# Altium project 1_led.PrjPcb
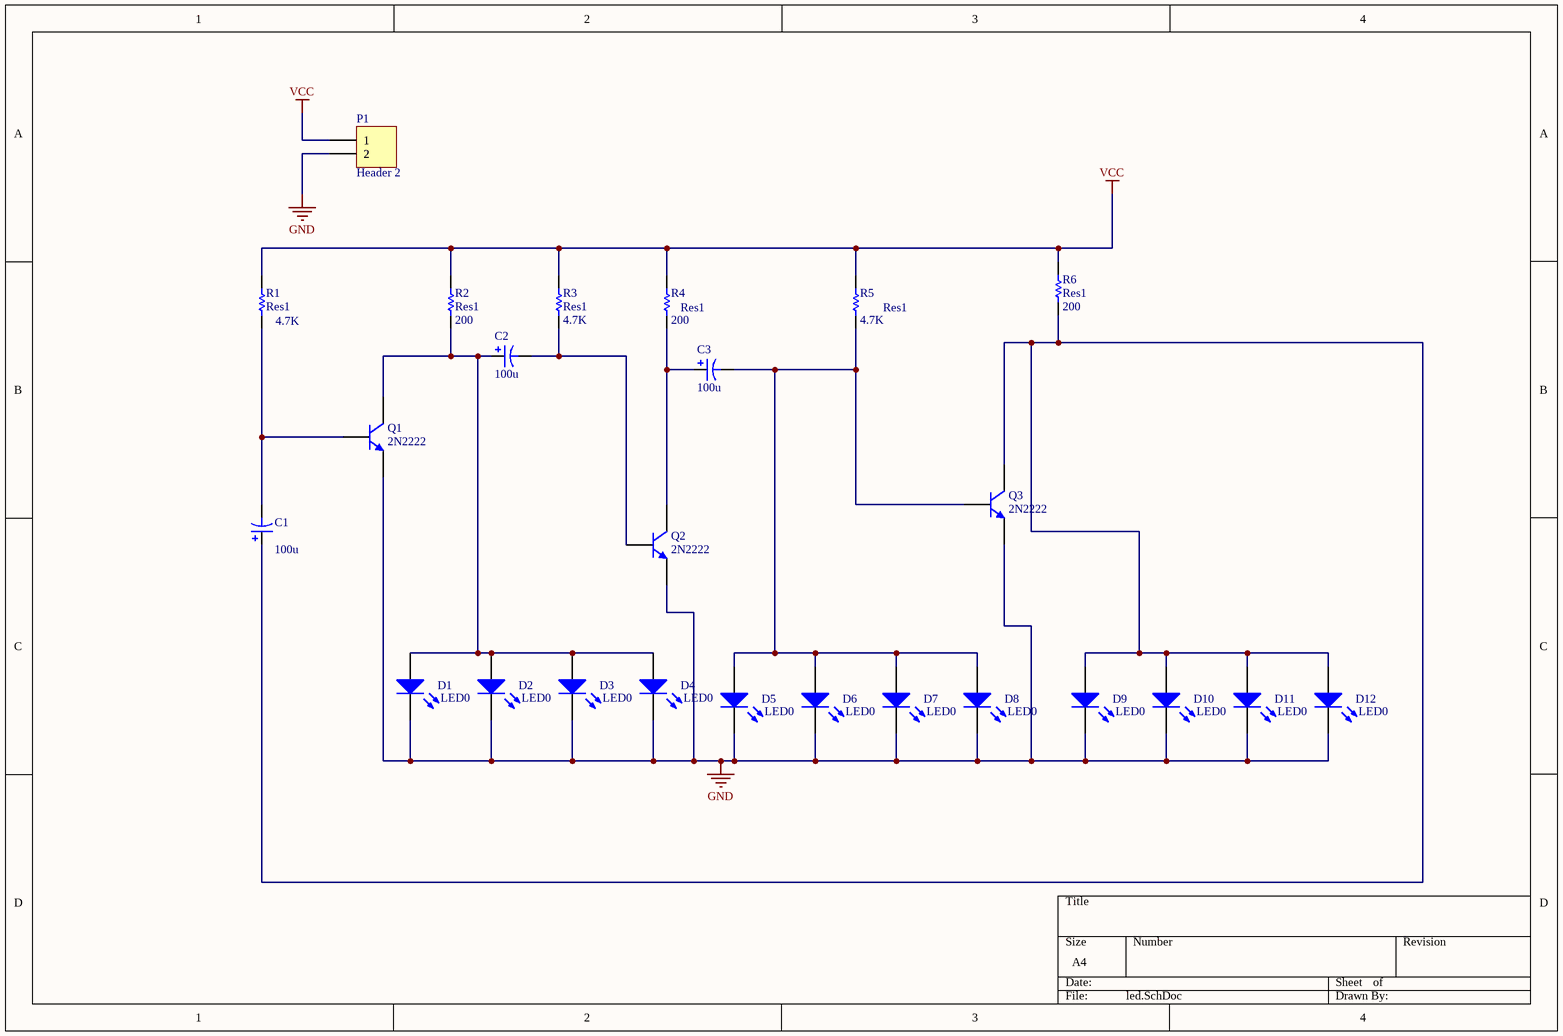
[diagram p0: led.SchDoc]
1 sheet, 25 parts. Net scope: global (net labels, ports and power ports of the same name join across sheets).
Board file: PCB1.PcbDoc

## Sheet led.SchDoc
size A4

### Parts
C1  value 100u  [RAD-0.1]  (hidden comment: Cap Pol1)
C2  value 100u  [RAD-0.1]  (hidden comment: Cap Pol1)
C3  value 100u  [RAD-0.1]  (hidden comment: Cap Pol1)
D1  LED0  [RAD-0.1]
D2  LED0  [RAD-0.1]
D3  LED0  [RAD-0.1]
D4  LED0  [RAD-0.1]
D5  LED0  [RAD-0.1]
D6  LED0  [RAD-0.1]
D7  LED0  [RAD-0.1]
D8  LED0  [RAD-0.1]
D9  LED0  [RAD-0.1]
D10  LED0  [RAD-0.1]
D11  LED0  [RAD-0.1]
D12  LED0  [RAD-0.1]
P1  Header 2  [HDR1X2]
Q1  2N2222  [TO-39]
Q2  2N2222  [TO-39]
Q3  2N2222  [TO-39]
R1  Res1  value 4.7K  [AXIAL-0.3]
R2  Res1  value 200  [AXIAL-0.3]
R3  Res1  value 4.7K  [AXIAL-0.3]
R4  Res1  value 200  [AXIAL-0.3]
R5  Res1  value 4.7K  [AXIAL-0.3]
R6  Res1  value 200  [AXIAL-0.3]

### Nets
GND: D1.2(K) D2.2(K) D3.2(K) D4.2(K) D5.2(K) D6.2(K) D7.2(K) D8.2(K) D9.2(K) D10.2(K) D11.2(K) D12.2(K) P1.2 Q1.1(E) Q2.1(E) Q3.1(E)
VCC: P1.1 R1.2 R2.2 R3.2 R4.2 R5.2 R6.2
NetC1_1: C1.1 D9.1(A) D10.1(A) D11.1(A) D12.1(A) Q3.3(C) R6.1
NetC1_2: C1.2 Q1.2(B) R1.1
NetC2_1: C2.1 D1.1(A) D2.1(A) D3.1(A) D4.1(A) Q1.3(C) R2.1
NetC2_2: C2.2 Q2.2(B) R3.1
NetC3_1: C3.1 Q2.3(C) R4.1
NetC3_2: C3.2 D5.1(A) D6.1(A) D7.1(A) D8.1(A) Q3.2(B) R5.1

### Library data of the parts
C1-C3 = Cap Pol1: Polarized Capacitor (Radial); Published: 8-Jun-2000; LatestRevisionDate: 17-Jul-2002; LatestRevisionNote: Re-released for DXP Platform.; PackageReference: RB7.6-15; Publisher: Altium Limited; PackageDescription: Polarized Capacitor (Radial); 2 Leads
D1-D12 = LED0: Typical INFRARED GaAs LED; Published: 8-Jun-2000; LatestRevisionDate: 08-Jul-2005; LatestRevisionNote: Mech Layer 1 removed.; PackageReference: LED-0; Publisher: Altium Limited; PackageDescription: LED; 2 Leads
P1 = Header 2: Header, 2-Pin; LatestRevisionDate: 17-Jul-2002; LatestRevisionNote: Re-released for DXP Platform.; Publisher: Altium Limited
Q1-Q3 = 2N3904: NPN General Purpose Amplifier; Published: 8-Jun-2000; LatestRevisionDate: 15-Jan-2003; LatestRevisionNote: PCB Footprint 'BCY-W3/D4.7' replaced; DatasheetVersion: 1997; PackageVersion: Sep-1998; PackageReference: TO-92A; Publisher: Altium Limited; PackageDescription: TO, Flat Index; 3 In-Line, Axial Leads; Body Dia. 4.5mm; Leads 0.51 x 0.48 mm (max); ComponentLink1Description: Manufacturer Link; ComponentLink1URL: http://www.fairchildsemi.com/; ComponentLink2Description: Datasheet; ComponentLink2URL: http://www.fairchildsemi.com/ds/2N%2F2N3904.pdf
R1-R6 = Res1: Resistor; Published: 8-Jun-2000; LatestRevisionDate: 17-Jul-2002; LatestRevisionNote: Re-released for DXP Platform.; PackageReference: AXIAL-0.3; Publisher: Altium Limited; PackageDescription: Axial Device, Thru-Hole; 2 Leads; 0.3 in Pin Spacing